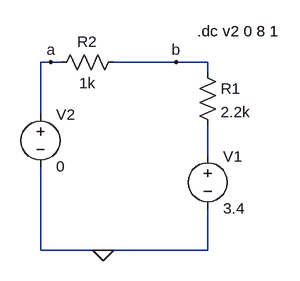
[diagram p0: schematic 250_CW2.asc]
250_CW2.asc, the LTspice schematic file:
Version 4
SHEET 1 880 680
WIRE 96 128 80 128
WIRE 112 128 96 128
WIRE 288 128 192 128
WIRE 336 128 288 128
WIRE 336 144 336 128
WIRE 80 208 80 128
WIRE 336 272 336 224
WIRE 80 416 80 288
WIRE 176 416 80 416
WIRE 336 416 336 352
WIRE 336 416 176 416
FLAG 96 128 a
FLAG 288 128 b
FLAG 176 416 0
SYMBOL res 320 128 R0
SYMATTR InstName R1
SYMATTR Value 2.2k
SYMBOL res 96 144 R270
WINDOW 0 32 56 VTop 2
WINDOW 3 0 56 VBottom 2
SYMATTR InstName R2
SYMATTR Value 1k
SYMBOL voltage 336 256 R0
WINDOW 123 0 0 Left 0
WINDOW 39 0 0 Left 0
SYMATTR InstName V1
SYMATTR Value 3.4
SYMBOL voltage 80 192 R0
WINDOW 123 0 0 Left 0
WINDOW 39 0 0 Left 0
SYMATTR InstName V2
SYMATTR Value 0
TEXT 320 80 Left 2 !.dc v2 0 8 1

The netlist it stands for:
* 250_CW2.asc
R1 b N001 2.2k
R2 a b 1k
V1 N001 0 3.4
V2 a 0 0
.dc v2 0 8 1
.backanno
.end